# Altium schematic sheet CP125-(12V2A)_V1.0.SchDoc
size A4
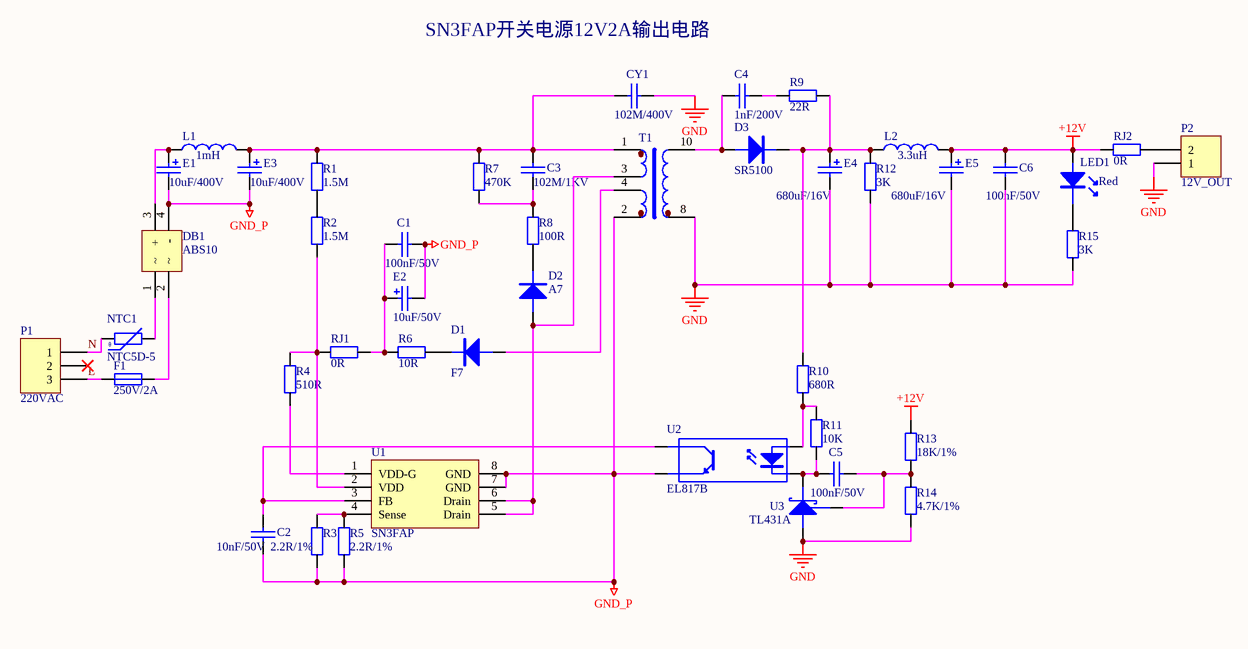
[diagram p0: CP125-(12V2A)_V1.0.SchDoc]

## Parts
C1  100nF/50V  [0805_C1]
C2  10nF/50V  [0805_C1]
C3  102M/1KV  [CY-5MM]
C4  1nF/200V  [0805_C1]
C5  100nF/50V  [0603_CN]
C6  100nF/50V  [0805_C1]
CY1  102M/400V  [CY-10MM]
D1  F7  [SOD-123]
D2  A7  [SOD-123]
D3  SR5100  [DO-201AD-1]
DB1  ABS10  [ABS10]
E1  10uF/400V  [CS_470uF/16V]
E2  10uF/50V  [CS_47uF/25V]
E3  10uF/400V  [CS_470uF/16V]
E4  680uF/16V  [CS_220uF/25V]
E5  680uF/16V  [CS_220uF/25V]
F1  250V/2A  [FUSE3*10MM-A]
L1  1mH  [Inductance-8*10]
L2  3.3uH  [Inductance-8*10]
LED1  Red  [3MM_LED]
NTC1  NTC5D-5  [NTC5D-5]
P1  220VAC  [KF5.08-3P]
P2  12V_OUT  [KF5.08-2P]
R1  1.5M  [1206_R]
R2  1.5M  [1206_R]
R3  2.2R/1%  [1206_R]
R4  510R  [0805_R]
R5  2.2R/1%  [1206_R]
R6  10R  [0805_R]
R7  470K  [1206_R]
R8  100R  [1206_R]
R9  22R  [1206_R]
R10  680R  [0603_RN]
R11  10K  [0603_RN]
R12  3K  [1206_R]
R13  18K/1%  [0603_RN]
R14  4.7K/1%  [0603_RN]
R15  3K  [0805_R]
RJ1  0R  [0805_R]
RJ2  0R  [1206_R]
T1  EF20  [EF20-H-5+5]  (value not drawn)
U1  SN3FAP  [DIP-8]
U2  EL817B  [DIP-4]
U3  TL431A  [TO-92B]

## Nets
+12V: C6.2 E5.1 L2.2 LED1.A R13.2 RJ2.2
GND: C6.1 CY1.2 E4.2 E5.2 P2.1 R12.1 R14.1 R15.1 T1.8 U3.2(A)
GND_P: C1.1 C2.2 DB1.4(-) E1.2 E2.2 E3.2 R3.1 R5.1 T1.2 U1.7(GND) U1.8(GND) U2.3(E)
L: F1.1 P1.3
N: NTC1.1 P1.1
NetC1_2: C1.2 E2.1 R6.1 RJ1.1
NetC2_1: C2.1 U1.3(FB) U2.4(C)
NetC3_1: C3.1 CY1.1 E3.1 L1.2 R1.2 R7.2 T1.1
NetC3_2: C3.2 R7.1 R8.2
NetC4_1: C4.1 D3.A T1.10
NetC4_2: C4.2 R9.1
NetC5_1: C5.1 R11.2 U2.2(K) U3.3(K)
NetC5_2: C5.2 R13.1 R14.2 U3.1(R)
NetD1_A: D1.A T1.4
NetD1_K: D1.K R6.2
NetD2_A: D2.A T1.3 U1.5(Drain) U1.6(Drain)
NetD2_K: D2.K R8.1
NetD3_K: D3.K E4.1 L2.1 R9.2 R10.1 R12.2
NetDB1_1: DB1.1 NTC1.2
NetDB1_2: DB1.2 F1.2
NetDB1_3: DB1.3(+) E1.1 L1.1
NetLED1_K: LED1.K R15.2
NetP2_2: P2.2 RJ2.1
NetR1_1: R1.1 R2.2
NetR2_1: R2.1 R4.2 RJ1.2 U1.2(VDD)
NetR3_2: R3.2 R5.2 U1.4(Sense)
NetR4_1: R4.1 U1.1(VDD-G)
NetR10_2: R10.2 R11.1 U2.1(A)

Not connected (* = marked no-connect by the designer): P1 2*

## Notes on the sheet
- SN3FAP开关电源12V2A输出电路
- (in symbol Res NTC) θ

## Library data of the parts
C1-C6 = Cap1
CY1 = Cap Y
D1-D3 = Diode-A: SS14,SS24,SS34,M7
DB1 = ABS10: 0.8A/1000V; component: Bridge Rectifiers; withstand voltage: 1000V; output current: 1A
E1-E5 = Cap Pol1: CS_100uF/16V: D=5mm , PIN Spacing= 2mm; CS_1000uF/16V: D=10mm , PIN Spacing= 3.5mm; CS_470uF/16V: D=8mm , PIN Spacing= 3.5mm; CS_100uF/25V: D=6.3mm , PIN Spacing= 2.5mm; CS_470uF/25V: D=10mm , PIN Spacing= 3.5mm; CS_1000uF/25V: D=10mm , PIN Spacing= 3.5mm; CS_220uF/25V: D=8mm , PIN Spacing= 3.5mm; CS_220uF/16V: D=6.3mm , PIN Spacing= 2.5mm; CS_47uF/25V: D=5mm , PIN Spacing= 2mm
F1 = FUSE1: Fuse
L1 L2 = Inductor: LQH1206: L=3.2mm,W=1.6mm,H=1.8mm; LQH2220: L=5.7mm,W=5mm,H=4.7mm; LQH1812: L=4.5mm,W=3.2mm,H=2.6mm; LQH1210: L=3.2mm,W=2.5mm,H=2mm; SMD1054: L=10mm,W=9mm,H=5.4mm; SMD5845: L=5.8mm,W=5.2mm,H=4.5mm; SMD7850: L=7.8mm,W=7mm,H=5mm; SMD1040: L=10mm,W=9mm,H=4mm; CDRH104: L=10mm,W=10mm,H=4.2mm; CDRH127: L=12mm,W=12mm,H=8mm; CDRH124: L=12mm,W=12mm,H=5mm; SMD7835: L=7.8mm,W=7mm,H=3.5mm; SMD3521: L=3.5mm,W=3.1mm,H=2.1mm; SMD4532: L=4.5mm,W=4mm,H=3.2mm; CDRH125: L=12mm,W=12mm,H=6.2mm; Inductance-8*10: D=8mm,H=10mm; Inductance-6*8: D=6mm,H=8mm; 0402_L: *; 1206_L: *; 0603_L: *; 1210_L: *; 0805_L: *
LED1 = LED
NTC1 = Res NTC
P1 = Header 3: Header, 3-Pin; LatestRevisionDate: 17-Jul-2002; LatestRevisionNote: Re-released for DXP Platform.; Publisher: Altium Limited
P2 = Header 2: Header, 2-Pin; LatestRevisionDate: 17-Jul-2002; LatestRevisionNote: Re-released for DXP Platform.; Publisher: Altium Limited
R1-R15 RJ1 RJ2 = Res1: Name: Resistor; Power: 0210(1/20W 25V), 0402(1/16W  50V),0603(1/16W  50V),0805(1/10W  150V),1206(1/8W  200V),1210(1/4W  200V),1812(1/2W  200V),2010(1/2W  200V),2512(1W  200V),
U2 = PC817
U3 = TL431